# EAGLE board proiect (EAGLE 9.7.0)
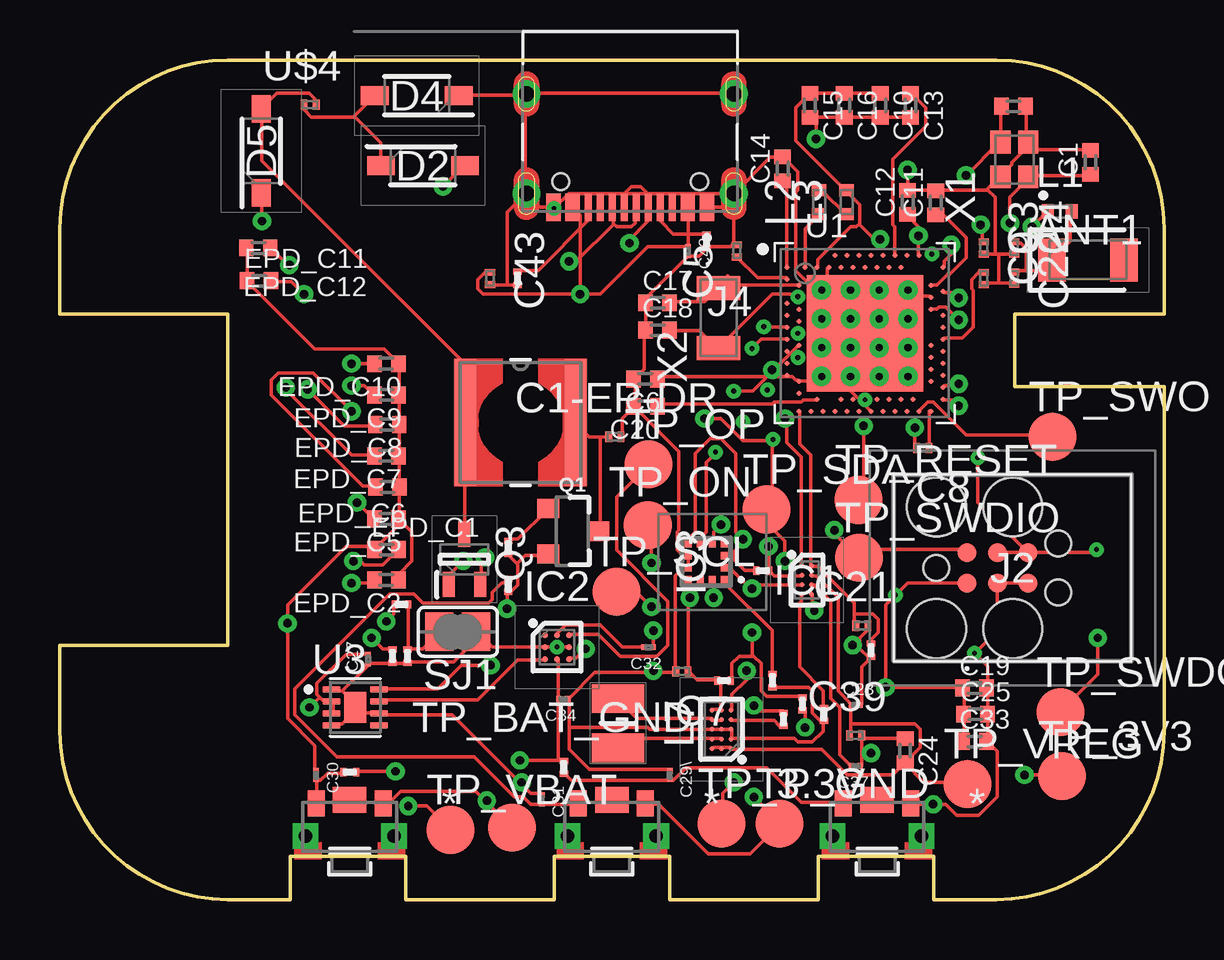
[diagram p2: board, top side]
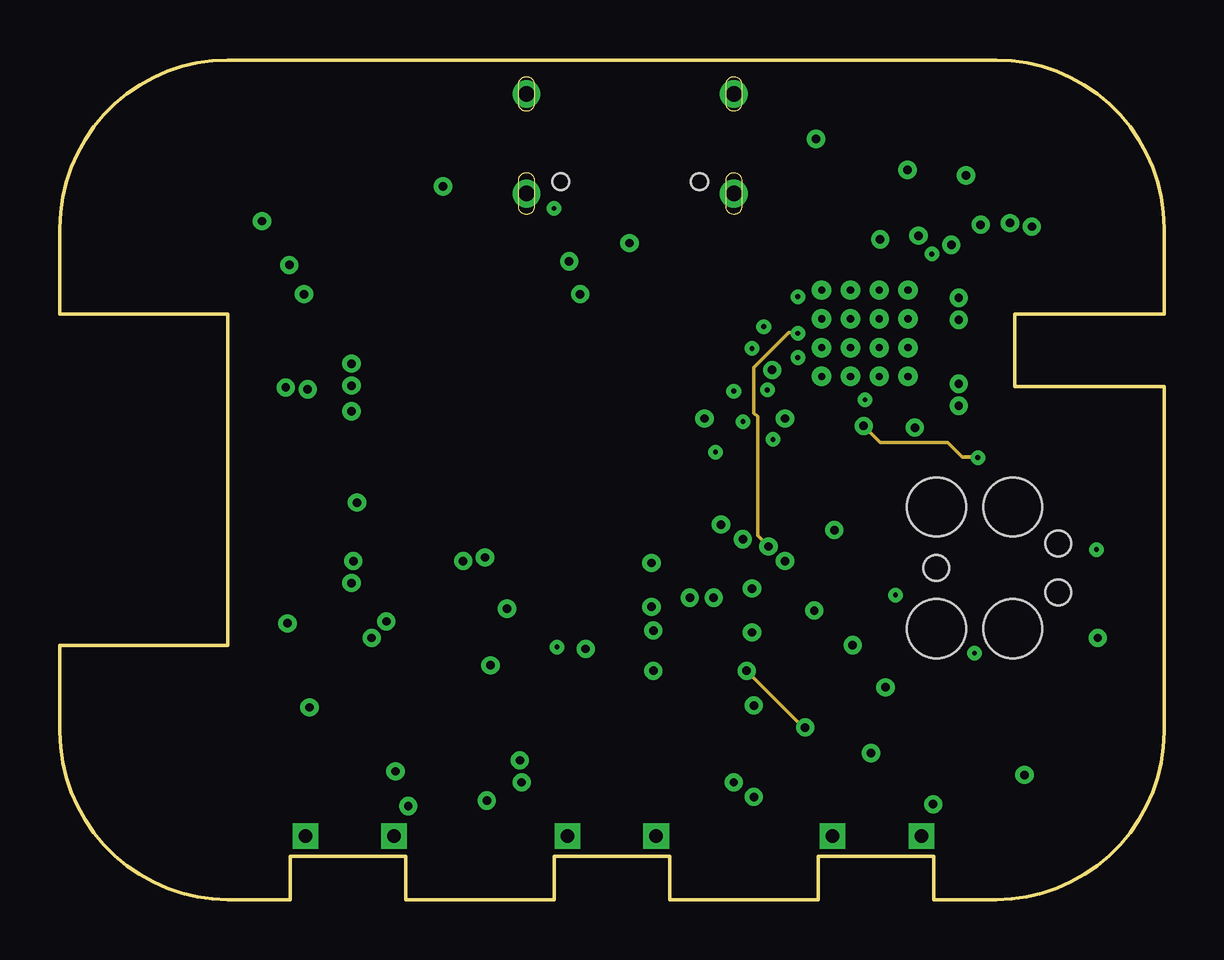
[diagram p3: board, inner layer Route2]
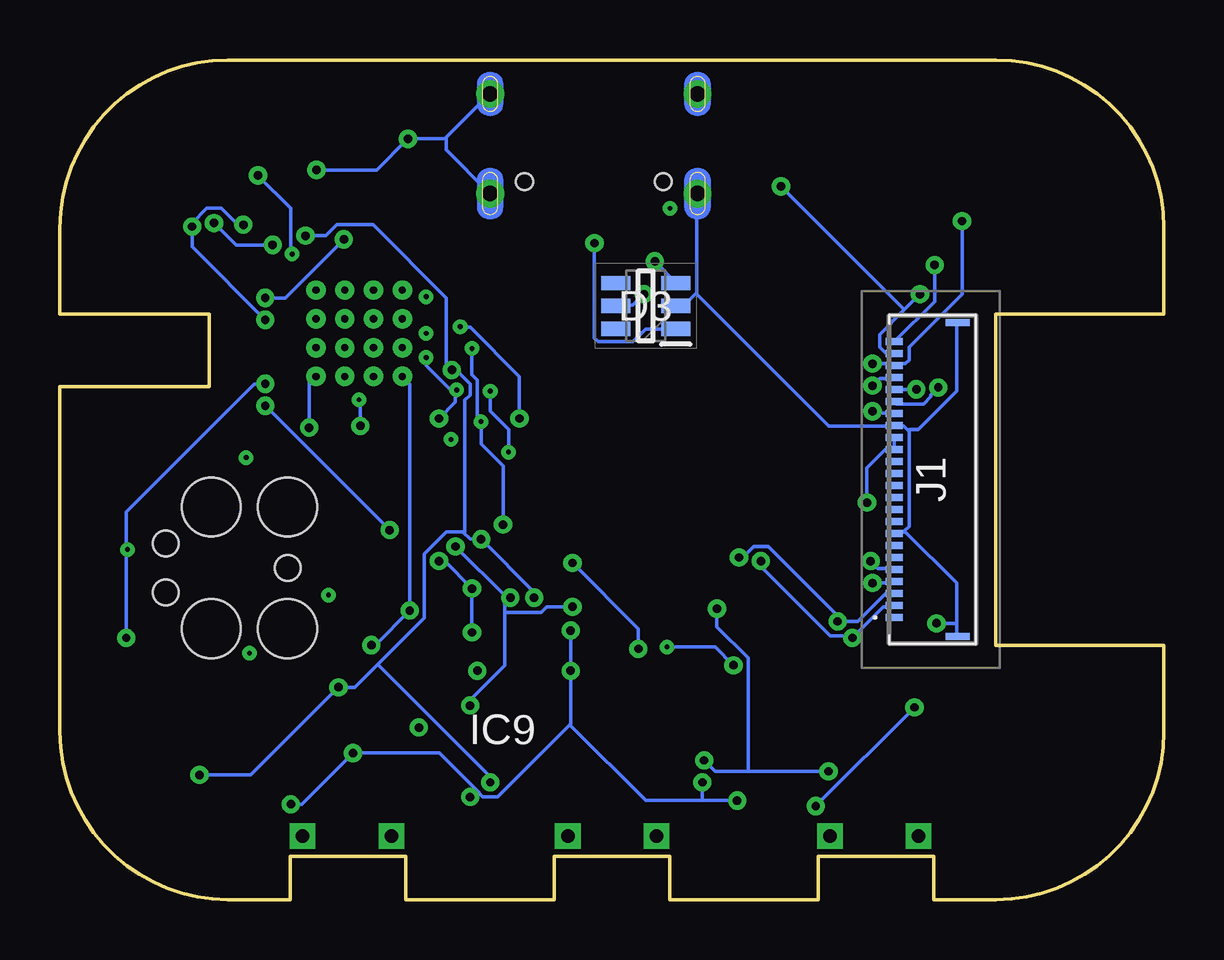
[diagram p4: board, bottom side, seen from below]

Size 46 x 35 mm. Coordinates in mm from the lower left corner, seen from the top.
Outline: 39,0 36.4,0 36.4,1.8 31.6,1.8 31.6,0 25.4,0 25.4,1.8 20.6,1.8 20.6,0 14.4,0 14.4,1.8 9.6,1.8 9.6,0 7,0 arc-90 0,7 0,10.6 7,10.6 7,24.4 0,24.4 0,28 arc-90 7,35 39,35 arc-90 46,28 46,24.66 46,24.41 45.75,24.41 39.78,24.41 39.78,23.02 39.78,21.38 40.52,21.38 46,21.38 46,7 arc-90 39,0
Copper layers (1+2*15+16): Top 0.035mm / dielectric 1.5mm / Route2 0.035mm / dielectric 0.15mm / Route15 0.035mm / dielectric 0.2mm / Bottom 0.035mm
Design rules "Fusion Electronics Design Rules *": minimum track width 6mil, minimum drill 0.35mm, track to track 6mil, track to pad 6mil, pad to pad 6mil, via to via 6mil, smd to smd 6mil, copper to edge 40mil, drill to drill 6mil, minimum pad ring 10mil, minimum via ring 8mil, stop-mask expansion 4mil, vias tented up to drill 9999mil, thermal gap 10mil
Net classes: 1 traseeDePutere: width 0.008 mm

## Footprints (pad centres in the part's own frame; a part is rotated, then mirrored left to right if it is on the bottom)
2450AT18B100E_ANTC3216X140N = smd 1.15 x 1.8: 1 -1.5,0; 2 1.5,0
PERFECT_0402_0402 = smd 0.6 x 0.7: 1 -0.5,0; 2 0.5,0
NORDIC_NRF_3_RESC0201_L = smd 0.28 x 0.43: 1 -0.255,0; 2 0.255,0
GRM011R60J152KE01L_2_CAPC0201X13N = smd 0.22 x 0.23: 1 -0.185,0; 2 0.185,0
GRM011R60J152KE01L_1_0201 = smd 0.35 x 0.25: 1 0,0.275; 2 0,-0.275
ESP32_C6_LIBRARY_5_SOD3716X135N = smd 1.15 x 0.8: 1 -1.75,0; 2 1.75,0
ESP32_C6_LIBRARY_3_SOT95P280X145-6N = smd 1.2 x 0.6: 1 -1.25,0.95; 2 -1.25,0; 3 -1.25,-0.95; 4 1.25,-0.95; 5 1.25,0; 6 1.25,0.95
BQ25180YBGR_BGA8C40P2X4_100X155X50 = smd 0.2 x 0.2: A1 -0.2,0.6; A2 0.2,0.6; B1 -0.2,0.2; B2 0.2,0.2; C1 -0.2,-0.2; C2 0.2,-0.2; D1 -0.2,-0.6; D2 0.2,-0.6
DRV2605YZFR_BGA9C50P3X3_144X144X62 = smd 0.25 x 0.25: A1 -0.5,0.5; A2 0,0.5; A3 0.5,0.5; B1 -0.5,0; B2 0,0; B3 0.5,0; C1 -0.5,-0.5; C2 0,-0.5; C3 0.5,-0.5
BMA423_BMA423 = smd 0.3 x 0.35: 1 -0.75,-0.775; 2 -0.25,-0.775; 3 0.25,-0.775; 4 0.75,-0.775; 7 0.75,0.775; 8 0.25,0.775; 9 -0.25,0.775; 10 -0.75,0.775 | smd 0.35 x 0.3: 5 0.775,-0.25; 6 0.775,0.25; 11 -0.775,0.25; 12 -0.775,-0.25
RT6160AWSC_BGA15C40P3X5_140X230X60 = smd 0.216 x 0.216: A1 -0.4,0.8; A2 0,0.8; A3 0.4,0.8; B1 -0.4,0.4; B2 0,0.4; B3 0.4,0.4; C1 -0.4,0; C2 0,0; C3 0.4,0; D1 -0.4,-0.4; D2 0,-0.4; D3 0.4,-0.4; E1 -0.4,-0.8; E2 0,-0.8; E3 0.4,-0.8
503480-2400_5034802400 = smd 0.3 x 0.7: 1 -5.75,1.525; 2 -5.25,1.525; 3 -4.75,1.525; 4 -4.25,1.525; 5 -3.75,1.525; 6 -3.25,1.525; 7 -2.75,1.525; 8 -2.25,1.525; 9 -1.75,1.525; 10 -1.25,1.525; 11 -0.75,1.525; 12 -0.25,1.525; 13 0.25,1.525; 14 0.75,1.525; 15 1.25,1.525; 16 1.75,1.525; 17 2.25,1.525; 18 2.75,1.525; 19 3.25,1.525; 20 3.75,1.525; 21 4.25,1.525; 22 4.75,1.525; 23 5.25,1.525; 24 5.75,1.525 | smd 0.3 x 1: MP1 -6.54,-1.125; MP2 6.54,-1.125
TC2030-IDC_TC2030IDC = smd 0.783 x 0.783: 1 -0.953,-0.635; 2 -0.953,0.635; 3 0.317,-0.635; 4 0.317,0.635; 5 1.588,-0.635; 6 1.588,0.635 | hole 2.451: -2.223,-2.54; -2.223,2.54; 0.952,-2.54; 0.952,2.54 | hole 1.067: -2.223,0; 2.857,-1.016; 2.857,1.016
KH-TYPE-C-16P_KINGHELM_KH-TYPE-C-16P = smd 0.6 x 1.15: A1_B12 -3.2,4.725; A4_B9 -2.4,4.725; A9_B4 2.4,4.725; A12_B1 3.2,4.725 | smd 0.3 x 1.15: A5 -1.25,4.725; A6 -0.25,4.725; A7 0.25,4.725; A8 1.25,4.725; B5 1.75,4.725; B6 0.75,4.725; B7 -0.75,4.725; B8 -1.75,4.725 | drill 0.65 pad 1.05: SH1 -4.32,0; SH2 4.32,0; SH3 -4.32,4.15; SH4 4.32,4.15 | hole 0.7: -2.89,3.65; 2.89,3.65
NORDIC_NRF_2_RESC0402_L = smd 0.5 x 0.6: 1 -0.5,0; 2 0.5,0
ESP32_C6_LIBRARY_2_IND_4828-WE-TPC_WRE = smd 0.9 x 5.3: 1 -2.286,0; 2 2.286,0
MLP2016SR47MT0S1_INDC2016X100N = smd 1.2 x 2.2: 1 -1.028,0; 2 1.028,0
ESP32_C6_LIBRARY_4_ESP32_C6_LIBRARY_4_ESP32_C6_LIBRARY_4_ESP32_C6_LIBRARY_4_ESP32_WROVER_SPARKFUN-DISCRETESEMI_SOT23-3 = smd 0.8 x 0.9: 1 -0.95,-1; 2 0.95,-1; 3 0,1.1
ESP32_C6_LIBRARY_6_SOT65P210X110-3N = smd 1.05 x 0.5: 1 -1.05,0.65; 2 -1.05,-0.65; 3 1.05,0
CPF0201D7K68C1_0201 = smd 0.35 x 0.25: 1 0,0.275; 2 0,-0.275
ESP32_C6_LIBRARY_7_JUMPER_SJ = smd 1.168 x 1.6: 1 -0.762,0; 2 0.762,0
2025-10-22_07-23-44_LIBRARY_SW_EVP-AKE31A_PAN = smd 0.711 x 1.092: 1 -1.4,-0.972; 2 1.4,-0.972 | drill 0.559 pad 0.914 square: 3 -1.848,0.381; 4 1.848,0.381 | smd 1.397 x 1.092: 5 0,-1.124
HECTOR_WATCH_1_TP20R = smd 2 x 2: TP 0,0
NORDIC_NRF_4_AQFN50P700X700X85_HS-74N = smd 4.85 x 4.85: P$74 0,0 | drill 0.3 pad 0.6: P$75 -1.8,1.8; P$76 -0.6,1.8; P$77 0.6,1.8; P$78 1.8,1.8; P$79 -1.8,0.6; P$80 -0.6,0.6; P$81 0.6,0.6; P$82 1.8,0.6; P$83 -1.8,-0.6; P$84 -0.6,-0.6; P$85 0.6,-0.6; P$86 1.8,-0.6; P$87 -1.8,-1.8; P$88 -0.6,-1.8; P$89 0.6,-1.8; P$90 1.8,-1.8 | smd 0.2 x 0.2: P$A8 -1.25,3.25; P$A10 -0.75,3.25; P$A12 -0.25,3.25; P$A14 0.25,3.25; P$A16 0.75,3.25; P$A18 1.25,3.25; P$A20 1.75,3.25; P$A22 2.25,3.25; P$A23 2.75,3.25; P$AA24 3.25,-2.25; P$AB2 -2.75,-2.5; P$AC5 -2,-2.75; P$AC9 -1,-2.75; P$AC11 -0.5,-2.75; P$AC13 0,-2.75; P$AC15 0.5,-2.75; P$AC17 1,-2.75; P$AC19 1.5,-2.75; P$AC21 2,-2.75; P$AC24 3.25,-2.75; P$AD2 -2.75,-3.25; P$AD4 -2.25,-3.25; P$AD6 -1.75,-3.25; P$AD8 -1.25,-3.25; P$AD10 -0.75,-3.25; P$AD12 -0.25,-3.25; P$AD14 0.25,-3.25; P$AD16 0.75,-3.25; P$AD18 1.25,-3.25; P$AD20 1.75,-3.25; P$AD22 2.25,-3.25; P$AD23 2.75,-3.25; P$B1 -3.25,2.75; P$B3 -2.5,2.75; P$B5 -2,2.75; P$B7 -1.5,2.75; P$B9 -1,2.75; P$B11 -0.5,2.75; P$B13 0,2.75; P$B15 0.5,2.75; P$B17 1,2.75; P$B19 1.5,2.75; P$B24 3.25,2.75; P$C1 -3.25,2.25; P$D2 -2.75,2; P$D23 2.75,2; P$E24 3.25,1.75; P$F2 -2.75,1.5; P$F23 2.75,1.5; P$G1 -3.25,1.25; P$H2 -2.75,1; P$H23 2.75,1; P$J1 -3.25,0.75; P$J24 3.25,0.75; P$K2 -2.75,0.5; P$L1 -3.25,0.25; P$L24 3.25,0.25; P$M2 -2.75,0; P$N1 -3.25,-0.25; P$N24 3.25,-0.25; P$P2 -2.75,-0.5; P$P23 2.75,-0.5; P$R1 -3.25,-0.75; P$R24 3.25,-0.75; P$T2 -2.75,-1; P$T23 2.75,-1; P$U1 -3.25,-1.25; P$U24 3.25,-1.25; P$V23 2.75,-1.5; P$W1 -3.25,-1.75; P$W24 3.25,-1.75; P$Y2 -2.75,-2; P$Y23 2.75,-2
ESP32_C6_LIBRARY_SON50P200X200X80-9N = smd 0.76 x 0.27: 1 -0.985,0.75; 2 -0.985,0.25; 3 -0.985,-0.25; 4 -0.985,-0.75; 5 0.985,-0.75; 6 0.985,-0.25; 7 0.985,0.25; 8 0.985,0.75 | smd 0.9 x 1.3: 9 0,0
NORDIC_NRF_BT-XTAL_2016_N = smd 0.95 x 0.85: 1 -0.725,-0.575; 2 0.725,-0.575; 3 0.725,0.575; 4 -0.725,0.575
NORDIC_NRF_1_XTAL_3215_N = smd 1 x 1.8: 1 -1.25,0; 2 1.25,0

## Placement (x,y rotation side)
ANT1  2450AT18B100E  [2450AT18B100E_ANTC3216X140N]  42.83,26.66 0 top
C1  12pF  [PERFECT_0402_0402]  42.94,30.73 90 top
C1-EP-DR  10uF  [NORDIC_NRF_3_RESC0201_L]  23.12,19.29 0 top
C2  12pF  [PERFECT_0402_0402]  39.72,33.07 0 top
C3  1pF  [NORDIC_NRF_3_RESC0201_L]  38.49,27.16 270 top
C4  1pF  [NORDIC_NRF_3_RESC0201_L]  39.76,27.16 270 top
C5  100nF  [NORDIC_NRF_3_RESC0201_L]  28.2,27.04 90 top
C6  4.7µF  [PERFECT_0402_0402]  24.39,21.7 180 top
C7  100nF  [NORDIC_NRF_3_RESC0201_L]  25.91,9.51 180 top
C8  100nF  [NORDIC_NRF_3_RESC0201_L]  35.95,18.82 180 top
C9  100nF  [NORDIC_NRF_3_RESC0201_L]  38.49,25.89 270 top
C10  N.C.  [PERFECT_0402_0402]  34.18,33.11 270 top
C11  100pF  [PERFECT_0402_0402]  36.49,29.04 90 top
C12  100nF  [PERFECT_0402_0402]  35.31,29.07 90 top
C13  N.C.  [PERFECT_0402_0402]  35.44,33.11 270 top
C14  4.7µF  [PERFECT_0402_0402]  30.11,30.47 90 top
C15  10µF  [PERFECT_0402_0402]  31.25,33.11 270 top
C16  47nF  [PERFECT_0402_0402]  32.68,33.11 270 top
C17  12pF  [PERFECT_0402_0402]  24.9,24.88 0 top
C18  12pF  [PERFECT_0402_0402]  24.9,23.73 0 top
C19  100nF  [PERFECT_0402_0402]  38.11,8.82 0 top
C20  4.7µF  [PERFECT_0402_0402]  24.39,20.56 180 top
C21  4.7µF  [NORDIC_NRF_3_RESC0201_L]  33.41,11.42 0 top
C22  N.C.  [NORDIC_NRF_3_RESC0201_L]  39.76,25.9 270 top
C23  0.1uF  [GRM011R60J152KE01L_2_CAPC0201X13N]  33.15,8.11 0 top
C24  10uF  [PERFECT_0402_0402]  35.22,6.21 270 top
C25  22uF  [PERFECT_0402_0402]  38.14,7.73 0 top
C27  0.1uF  [GRM011R60J152KE01L_2_CAPC0201X13N]  12.83,10.02 90 top
C29\  1uF  [GRM011R60J152KE01L_2_CAPC0201X13N]  25.41,5.19 270 top
C30  1uF  [GRM011R60J152KE01L_2_CAPC0201X13N]  10.67,5.19 270 top
C31  1uF  [GRM011R60J152KE01L_2_CAPC0201X13N]  20.07,4.18 270 top
C32  1uF  [GRM011R60J152KE01L_2_CAPC0201X13N]  24.52,10.53 180 top
C33  22uF  [PERFECT_0402_0402]  38.11,6.59 0 top
C34  0.1uF  [GRM011R60J152KE01L_2_CAPC0201X13N]  20.96,8.37 180 top
C37  1uF  [GRM011R60J152KE01L_2_CAPC0201X13N]  33.15,5.57 180 top
C38  1uF  [GRM011R60J152KE01L_1_0201]  33.79,10.39 180 top
C39  10uF  [NORDIC_NRF_3_RESC0201_L]  33.15,6.84 0 top
C42  0.1uF  [GRM011R60J152KE01L_2_CAPC0201X13N]  26.17,27.04 270 top
C43  4.3uF  [NORDIC_NRF_3_RESC0201_L]  17.91,25.89 270 top
D2  MBR0530  [ESP32_C6_LIBRARY_5_SOD3716X135N]  15.12,30.59 0 top
D3  USBLC6-2SC6Y  [ESP32_C6_LIBRARY_3_SOT95P280X145-6N]  21.6,24.75 180 bottom
D4  MBR0530  [ESP32_C6_LIBRARY_5_SOD3716X135N]  14.87,33.51 180 top
D5  MBR0530  [ESP32_C6_LIBRARY_5_SOD3716X135N]  8.39,31.2 90 top
EPD_C1  1uF/50V  [PERFECT_0402_0402]  13.6,14.59 0 top
EPD_C2  1uF/1.5V  [PERFECT_0402_0402]  13.6,13.32 180 top
EPD_C5  0.1uF/50V  [PERFECT_0402_0402]  13.6,15.86 180 top
EPD_C6  1uF/1.5V  [PERFECT_0402_0402]  13.65,17.19 180 top
EPD_C7  1uF/1.5V  [PERFECT_0402_0402]  13.6,18.49 180 top
EPD_C8  1uF/1.5V  [PERFECT_0402_0402]  13.64,19.8 180 top
EPD_C9  1uF/1.5V  [PERFECT_0402_0402]  13.61,21.03 180 top
EPD_C10  1uF/1.5V  [PERFECT_0402_0402]  13.6,22.34 180 top
EPD_C11  1uF/1.5V  [PERFECT_0402_0402]  8.3,25.8 0 top
EPD_C12  1uF/1.5V  [PERFECT_0402_0402]  8.26,27.16 0 top
IC1  BQ25180YBGR  [BQ25180YBGR_BGA8C40P2X4_100X155X50]  31.12,13.32 0 top
IC2  DRV2605YZFR  [DRV2605YZFR_BGA9C50P3X3_144X144X62]  20.71,10.53 0 top
IC3  BMA423  [BMA423_BMA423]  26.93,14.08 90 top
IC9  RT6160AWSC  [RT6160AWSC_BGA15C40P3X5_140X230X60]  27.57,7.1 180 top
J1  503480-2400  [503480-2400_5034802400]  9.72,17.51 90 bottom
J2  TC2030-IDC_TC2030-IDC  [TC2030-IDC_TC2030IDC]  38.74,13.83 0 top
J4  KH-TYPE-C-16P  [KH-TYPE-C-16P_KINGHELM_KH-TYPE-C-16P]  23.76,33.58 180 top
L1  3.9nH  [NORDIC_NRF_2_RESC0402_L]  41.66,28.69 0 top
L2  10uH  [NORDIC_NRF_2_RESC0402_L]  31.63,29.07 90 top
L3  15nH  [NORDIC_NRF_2_RESC0402_L]  32.77,29.07 90 top
L5  68uH  [ESP32_C6_LIBRARY_2_IND_4828-WE-TPC_WRE]  19.19,19.89 0 top
L7  FTC252012SR47MBCA  [MLP2016SR47MT0S1_INDC2016X100N]  23.25,7.35 90 top
Q1  20V/4.2A/52mΩ/1.4W  [ESP32_C6_LIBRARY_4_ESP32_C6_LIBRARY_4_ESP32_C6_LIBRARY_4_ESP32_C6_LIBRARY_4_ESP32_WROVER_SPARKFUN-DISCRETESEMI_SOT23-3]  21.34,15.35 270 top
Q3  \SI1308EDL-T1-GE3  [ESP32_C6_LIBRARY_6_SOT65P210X110-3N]  16.85,14.18 90 top
R1  10K  [CPF0201D7K68C1_0201]  31.83,7.72 180 top
R1_EP_DR  0.47  [CPF0201D7K68C1_0201]  14.23,12.3 270 top
R1_USB  5K1  [CPF0201D7K68C1_0201]  26.93,27.44 180 top
R2  0  [CPF0201D7K68C1_0201]  30.93,8.15 0 top
R2_EP_DR  10K  [CPF0201D7K68C1_0201]  13.85,10.15 180 top
R2_USB  5K1  [CPF0201D7K68C1_0201]  19.06,25.89 0 top
R3  0  [CPF0201D7K68C1_0201]  29.69,9.13 180 top
R4  0  [CPF0201D7K68C1_0201]  30.14,7.51 0 top
R5  10K  [CPF0201D7K68C1_0201]  12.07,5.32 90 top
R7  10K  [CPF0201D7K68C1_0201]  20.99,5.51 180 top
R8  10K  [CPF0201D7K68C1_0201]  18.68,13.09 0 top
R17  3K3  [CPF0201D7K68C1_0201]  29.28,13.71 90 top
R18  3K3  [CPF0201D7K68C1_0201]  27.66,9.13 90 top
R_PWR_EPD  10K  [CPF0201D7K68C1_0201]  18.68,14.68 0 top
R_TYPE_SEL  2.2  [CPF0201D7K68C1_0201]  14.48,10.15 180 top
SJ1  [ESP32_C6_LIBRARY_7_JUMPER_SJ]  16.57,11.16 180 top
SW_DN  2025-10-22_07-23-44_LIBRARY_EVP-AKE31ASW_EVP-AKE31A_PAN  [2025-10-22_07-23-44_LIBRARY_SW_EVP-AKE31A_PAN]  34.04,3.03 180 top
SW_ENT  2025-10-22_07-23-44_LIBRARY_EVP-AKE31ASW_EVP-AKE31A_PAN  [2025-10-22_07-23-44_LIBRARY_SW_EVP-AKE31A_PAN]  22.99,3.03 180 top
SW_UP  2025-10-22_07-23-44_LIBRARY_EVP-AKE31ASW_EVP-AKE31A_PAN  [2025-10-22_07-23-44_LIBRARY_SW_EVP-AKE31A_PAN]  12.07,3.03 180 top
TP_3.3V  HECTOR_WATCH_1_TPTP20R  [HECTOR_WATCH_1_TP20R]  27.57,3.16 0 top
TP_3V3  HECTOR_WATCH_1_TPTP20R  [HECTOR_WATCH_1_TP20R]  41.75,5.14 0 top
TP_BAT_GND  HECTOR_WATCH_1_TPTP20R  [HECTOR_WATCH_1_TP20R]  18.84,3 0 top
TP_GND  HECTOR_WATCH_1_TPTP20R  [HECTOR_WATCH_1_TP20R]  29.98,3.16 0 top
TP_ON  HECTOR_WATCH_1_TPTP20R  [HECTOR_WATCH_1_TP20R]  24.49,15.61 0 top
TP_OP  HECTOR_WATCH_1_TPTP20R  [HECTOR_WATCH_1_TP20R]  24.52,18.14 0 top
TP_RESET  HECTOR_WATCH_1_TPTP20R  [HECTOR_WATCH_1_TP20R]  33.28,16.66 0 top
TP_SCL  HECTOR_WATCH_1_TPTP20R  [HECTOR_WATCH_1_TP20R]  23.19,12.83 0 top
TP_SDA  HECTOR_WATCH_1_TPTP20R  [HECTOR_WATCH_1_TP20R]  29.44,16.26 0 top
TP_SWDCLK  HECTOR_WATCH_1_TPTP20R  [HECTOR_WATCH_1_TP20R]  41.68,7.8 0 top
TP_SWDIO  HECTOR_WATCH_1_TPTP20R  [HECTOR_WATCH_1_TP20R]  33.3,14.25 0 top
TP_SWO  HECTOR_WATCH_1_TPTP20R  [HECTOR_WATCH_1_TP20R]  41.35,19.29 0 top
TP_VBAT  HECTOR_WATCH_1_TPTP20R  [HECTOR_WATCH_1_TP20R]  16.26,2.91 0 top
TP_VREG  HECTOR_WATCH_1_TPTP20R  [HECTOR_WATCH_1_TP20R]  37.81,4.82 0 top
U1  NRF52840_QF  [NORDIC_NRF_4_AQFN50P700X700X85_HS-74N]  33.53,23.61 0 top
U3  MAX17048G+T10  [ESP32_C6_LIBRARY_SON50P200X200X80-9N]  12.3,8.01 0 top
U$4  4.7uF/25V  [NORDIC_NRF_3_RESC0201_L]  10.42,33.13 0 top
X1  32MHz  [NORDIC_NRF_BT-XTAL_2016_N]  39.77,30.85 90 top
X2  32.768kHz  [NORDIC_NRF_1_XTAL_3215_N]  27.44,24.25 90 top

## Tracks (layer width: path | path; a pad name or v marks a point on that pad's centre or on a via)
3V3/1.7D  (via drill 0.35)
  Top 0.152: 19.04,13.99 18.7,14.34 R_PWR_EPD.2 | 19.04,13.99 19.08,13.95 19.08,13.12 18.85,12.89 18.7,12.89 R8.2 18.62,12.81 v18.62,12.13 | Q1.2 20.3,14.34 19.39,14.34 19.08,14.03 19.04,13.99 | IC2.C2 20.76,9.99 20.76,8.39 C34.2 20.76,8.32 20.76,5.8 | v13.98,5.34 12.38,5.34 R5.2 | 20.76,5.8 20.99,5.8 R7.2 | 20.76,5.8 v19.16,5.8
  Bottom 0.152: 17.33,5.34 18.7,5.34 v19.16,5.8 | 17.33,5.34 v13.98,5.34 | v18.62,12.13 18.62,11.36 17.33,10.07 17.33,5.34
3V3/2.4A  (via drill 0.2, 0.35)
  Top 0.152: 27.54,7.94 27.24,7.94 IC9.E3 | 27.54,7.94 IC9.E2 | 27.54,7.94 27.54,8.01 27.54,9 27.46,9.08 R18.1 27.39,9.15 26.55,9.15 26.24,9.46 C7.1 26.17,9.54 26.17,12.58 | 26.17,12.58 26.17,13.27 IC3.10 | 28.04,14.22 28,14.26 27.77,14.26 IC3.3 | 28.04,14.22 28.11,14.15 | 28.11,14.15 28.53,13.73 28.99,13.73 R17.1 | IC3.7 26.17,14.87 26.17,15.02 26.47,15.33 26.47,18.6 27.08,19.21 27.54,19.21 28.15,18.6 28.15,15.33 v28.45,15.02 28.38,15.02 28.38,14.79 28.07,14.49 28.07,14.26 28.04,14.22 | 28.15,14.18 28.11,14.15 | C33.1 37.67,6.64 37.67,7.71 C25.1 37.67,7.78 37.67,8.77 C19.1 37.6,8.85 v34.4,8.85 34.4,12.28 v34.81,12.7 35.31,13.19 J2.1 | U1.P$A22 35.77,26.91 v35.77,27.67 35.77,28.05 35.31,28.51 C12.1 | U1.P$W1 30.36,21.8 30.44,21.8 30.51,21.8 30.66,21.65 30.74,21.65 U1.P$Y2 32.53,21.61 U1.P$AD14 | 25.03,21.8 24.95,21.73 C6.1 25.03,21.8 | 30.28,21.8 U1.P$W1 | v28.07,4.89 27.62,4.43 27.62,3.21 TP_3.3V.TP | v40.19,5.19 41.71,5.19 TP_3V3.TP | v26.24,12.58 26.17,12.58 | 29.67,21.8 v29.67,22.08 | 29.67,21.8 30.21,21.8 U1.P$W1 | 29.67,21.8 v29.67,22.08 | 25.03,21.8 29.6,21.8 v29.67,22.08
  Bottom 0.152: v35.77,27.67 34.93,27.67 34.48,28.13 32.95,28.13 29.9,25.08 29.9,22.34 29.67,22.11 v29.67,22.08 | 32.76,9.8 30.82,11.75 30.82,14.41 29.9,15.33 29.22,15.33 29.18,15.29 | 32.76,9.8 33.71,8.85 v34.4,8.85 38.06,5.19 v40.19,5.19 | 29.18,15.29 28.91,15.02 v28.45,15.02 26.24,12.81 v26.24,12.58 | v28.07,4.89 28.07,5.12 32.72,9.76 32.76,9.8 | v29.67,22.08 | 29.18,15.29 29.14,15.33 29.14,20.81 28.91,21.04 28.91,21.5 29.45,22.03 29.6,22.03 v29.67,22.08
DN  (via drill 0.35)
  Top 0.152: J4.A7 23.58,28.89 23.58,29.5 23.81,29.73 24.19,29.73 24.49,29.42 24.49,28.89 J4.B7 24.49,28.81 24.49,28.28 23.73,27.52 v23.73,27.37
  Bottom 0.152: v23.73,27.37 23.73,23.4 23.58,23.25 22.13,23.25 21.6,23.79 20.38,23.79 D3.1
DP  (via drill 0.35)
  Top 0.152: 23.08,28.17 23.2,28.05 23.81,28.05 23.96,28.2 23.96,28.81 J4.A6 | 23.08,28.17 23.04,28.2 23.04,28.81 J4.B6 | v21.22,26.6 21.52,26.6 23.04,28.13 23.08,28.17
  Bottom 0.152: v21.22,26.6 20.38,25.77 D3.3
EPD_3V3
  Top 0.152: 22.51,19.29 22.05,19.29 21.52,19.82 L5.2 | 22.51,19.29 22.82,19.29 C1-EP-DR.1 | 22.51,19.29 22.51,15.4 Q1.3
GDR  (via drill 0.35)
  Top 0.152: v12.99,10.91 13.44,10.45 13.82,10.45 R2_EP_DR.2 | v16.8,14.11 16.26,13.57 16.26,13.19 Q3.1
  Bottom 0.152: J1.2 11.31,12.2 11.69,12.2 v12.99,10.91 12.99,10.98 13.9,10.98 16.8,13.88 v16.8,14.11
GND  (via drill 0.2, 0.35)
  Top 0.152: 19.2,4.85 16.34,7.71 13.29,7.71 U3.6 13.21,7.78 12.3,7.78 U3.9 | 19.2,4.85 19.62,4.43 20.07,4.43 C31.1 | U3.4 11.39,7.33 11.77,7.33 12.38,7.94 U3.9 | 11.77,8.7 11.39,8.7 U3.1 | 11.77,8.7 12.3,8.16 U3.9 | U3.9 | 11.77,8.7 12.83,9.76 C27.1 13.82,9.84 R2_EP_DR.1 13.9,9.84 14.43,9.84 R_TYPE_SEL.1 14.51,9.92 16.41,9.92 17.48,10.98 SJ1.1 17.41,11.14 18.02,10.53 20.15,10.53 IC2.B1 IC2.B3 | SW_ENT.1 24.42,3.97 24.95,3.97 27.01,1.92 28.76,1.92 29.98,3.14 TP_GND.TP 29.98,3.21 v28.91,4.28 | 17.75,4.09 18.78,3.06 TP_BAT_GND.TP | 17.75,4.09 17.33,4.51 14.21,4.51 13.75,4.05 13.52,4.05 SW_UP.1 | 38.67,8.24 38.67,7.78 C25.2 38.67,7.71 38.67,6.64 C33.2 38.67,6.56 39.05,6.18 39.05,4.28 38.28,3.52 37.37,3.52 36.91,3.97 v36.38,3.97 35.46,3.97 SW_DN.1 | 38.67,8.24 38.67,8.77 C19.2 | 28,6.72 28,7.1 IC9.C1 27.92,7.1 27.62,7.1 IC9.C2 27.54,7.1 27.24,7.1 IC9.C3 24.57,7.1 24.49,7.17 21.22,7.17 | 28,6.72 IC9.B1 | R3.1 29.75,8.85 31.2,8.85 31.35,8.7 31.35,7.78 31.66,7.48 31.81,7.48 R1.1 31.81,7.4 31.81,7.02 31.35,6.56 30.74,6.56 30.59,6.72 28.07,6.72 28,6.72 | 33.41,6.72 33.41,6.79 C39.2 33.41,6.72 | 33.41,6.72 33.41,6.11 | 33.41,6.11 33.41,5.57 C37.1 | 33.41,6.72 35.16,6.72 C24.1 | 24.72,9.46 25.64,9.46 C7.2 | 24.72,9.46 22.28,9.46 21.22,8.39 C34.1 21.22,8.32 21.22,7.17 | v24.72,11.21 24.72,10.53 C32.1 | 24.72,9.46 v24.72,9.54 | 21.22,7.17 21.22,6.26 22.05,5.42 25.41,5.42 C29\.1 | 25.64,9.54 C7.2 | v33.79,6.11 33.41,6.11 | v17.79,4.12 17.75,4.09 | v19.23,4.89 19.2,4.85 | C30.1 10.62,5.42 10.62,6.41 9.48,7.55 v9.48,11.52 9.48,12.28 11.92,14.72 12.99,14.72 13.06,14.64 EPD_C1.1 13.14,14.64 14.21,15.71 EPD_C5.1
  Top 0.152: 14.13,15.86 14.66,15.33 14.66,14.11 14.13,13.57 14.13,13.34 EPD_C2.1 | 14.13,15.86 EPD_C5.1 | EPD_C12.1 7.8,27.14 7.8,25.84 EPD_C11.1 7.8,25.77 10.62,22.95 13.52,22.95 14.13,22.34 | 14.13,22.34 14.13,21.04 EPD_C9.1 14.13,20.97 14.13,19.82 EPD_C8.1 14.13,19.75 14.13,18.53 EPD_C7.1 14.13,18.45 14.13,17.23 EPD_C6.1 14.13,17.16 14.13,15.86 | 14.13,22.34 EPD_C10.1 14.13,22.34 | 14.13,15.86 EPD_C5.1 | v35.62,19.67 35.62,18.83 C8.2 | U1.P$B7 31.96,26.3 31.96,25.61 31.81,25.46 U1.P$74 | U1.P$F23 36.23,25.16 35.62,25.16 35.39,25.39 U1.P$74 | U1.P$83 31.81,23.02 32.88,23.02 U1.P$74 | U1.P$79 31.81,24.24 31.96,24.24 32.42,24.7 U1.P$74 | U1.P$74 31.73,25.46 U1.P$75 31.66,25.46 31.43,25.46 30.66,26.22 30.66,29.5 30.74,29.58 30.74,30.34 30.13,30.95 C14.2 30.05,30.95 29.6,30.95 28.15,29.5 J4.SH3 | U1.P$74 32.95,23.02 U1.P$84 32.95,22.95 32.95,21.88 U1.P$88 32.88,21.8 31.81,21.8 U1.P$87 | U1.P$80 32.95,24.24 U1.P$74 | U1.P$76 32.88,25.39 32.34,24.85 U1.P$74 | U1.P$74 34.17,22.95 34.17,21.88 U1.P$89 34.25,21.88 35.31,21.88 U1.P$90 | U1.P$74 34.17,23.02 U1.P$85 34.25,23.02 35.31,23.02 U1.P$86 | U1.P$81 34.17,24.24 U1.P$74 | 34.78,24.78 35.31,24.24 U1.P$82 | 34.78,24.78 U1.P$74 | 34.78,24.78 34.17,25.39 U1.P$77 | 34.78,24.78 U1.P$74 | U1.P$78 35.39,25.46 U1.P$74 | C23.2 33.41,8.16 33.41,9.69 33.79,10.07 C38.1 33.71,10.07 33.33,10.45 33.33,10.6 | 33.33,10.6 33.33,10.91 33.64,11.21 33.64,11.36 C21.2 | v31.43,12.05 31.35,12.13 31.35,12.66 IC1.D2 | 33.33,10.6 v33.03,10.6 | 39.12,26.91 39.73,26.91 C4.2 | 39.12,26.91 38.97,26.91 | 38.97,26.91 38.51,26.91 C3.2 | 39.12,25.69 39.73,25.69 C22.2
  Top 0.152: 39.12,25.69 38.51,25.69 C9.2 | 39.12,25.69 39.12,26.91 | C12.2 36.46,29.58 C11.2 36.53,29.58 38.59,29.58 38.63,29.61 | C12.2 | C2.2 40.27,33.01 40.27,31.71 40.34,31.63 X1.2 | C1.2 42.93,31.25 40.72,31.25 40.42,31.56 X1.2 | X1.2 40.42,31.48 39.66,30.72 39.66,30.64 39.2,30.19 X1.4 39.12,30.11 38.63,29.61 | 38.97,26.91 38.97,29.27 38.67,29.58 38.63,29.61 | 18.62,25.61 17.94,25.61 C43.2 | 18.62,25.61 19.01,25.61 R2_USB.2 | 19.44,29.45 19.46,29.5 J4.SH4 | J4.SH4 19.39,29.5 19.39,33.54 J4.SH2 | 18.62,25.61 18.62,28.66 19.39,29.42 J4.SH4 | D4.1 16.64,33.54 19.31,33.54 J4.SH2 | C13.2 35.39,32.62 34.25,32.62 C10.2 34.17,32.62 32.72,32.62 C16.2 32.65,32.62 31.5,32.62 | 31.5,32.62 31.27,32.62 C15.2 31.5,32.62 | v31.5,31.71 31.5,32.62 | C1-EP-DR.2 23.43,19.29 23.43,20.05 23.88,20.51 C20.2 | C20.2 23.96,20.58 23.96,21.65 C6.2 23.96,21.73 24.34,22.11 24.34,23.71 C18.1 24.42,23.79 24.42,24.85 C17.1 24.42,24.93 24.42,25.08 26.17,26.83 | 26.17,26.83 26.63,26.83 26.93,27.14 R1_USB.1 26.93,27.21 27.92,27.21 28.07,27.37 C5.2 28.15,27.37 28.07,27.44 28.07,29.27 | 26.17,26.83 C42.2 26.17,26.83 | v28.07,29.32 28.07,29.35 J4.SH3 | 28.07,29.27 J4.SH3 | J4.SH2 19.46,33.62 28.07,33.62 J4.SH1 | v35.31,30.41 C12.2 | 23.96,20.51 C20.2 | C7.2 25.64,9.61 25.64,13.5 25.94,13.8 26.09,13.8 IC3.9 26.17,13.88 26.17,14.26 IC3.8 26.09,14.34 25.94,14.34 25.71,14.56 25.71,15.33 25.79,15.4 25.79,18.68 23.96,20.51 | 23.96,20.51 C20.2 | 38.67,8.24 38.67,9.71 v38.11,10.27 39.06,11.22 J2.3 J2.5 | J4.A1_B12 27.66,28.86 28.07,29.27 | J4.SH4 20.01,28.86 J4.A12_B1 | J4.SH3 21.2,29.43 v20.58,28.81
  Bottom 0.152: v24.72,11.21 v24.72,9.54 24.72,7.33 24.76,7.29 | 28.64,4.54 28.38,4.28 27.77,4.28 24.76,7.29 | 28.64,4.54 30.21,6.11 v33.79,6.11 35.92,3.97 v36.38,3.97 | 19.23,4.12 21.6,4.12 24.72,7.25 24.76,7.29 | 19.23,4.12 v17.79,4.12 | v28.91,4.28 28.68,4.51 28.64,4.54 | 19.23,4.12 v19.23,4.89 | v35.62,19.67 35.62,21.58 35.39,21.8 U1.P$90 | U1.P$87 31.43,21.5 v31.43,12.05 32.88,10.6 v33.03,10.6 | 10.81,15.37 10.62,15.56 10.62,19.52 10.66,19.56 | 10.81,15.37 10.85,15.33 11.23,15.33 J1.8 | 10.66,19.56 10.85,19.75 11.23,19.75 J1.17 11.31,19.75 13.98,19.75 19.46,25.23 19.5,25.27 | 8.64,11.52 8.64,13.19 10.78,15.33 10.81,15.37 | 8.64,11.52 8.64,10.98 J1.MP1 | J1.MP2 8.64,24.01 8.64,21.19 10.24,19.59 10.62,19.59 10.66,19.56 | 19.5,25.27 19.46,25.31 19.46,29.42 J4.SH4 | 19.5,25.27 20,24.78 20.3,24.78 D3.2 | 29.94,31.75 28.15,33.54 J4.SH1 | 29.94,31.75 29.98,31.71 v31.5,31.71 32.8,30.41 v35.31,30.41 | 29.94,31.75 29.9,31.71 29.9,31.25 28.15,29.5 J4.SH3 | 8.64,11.52 v9.48,11.52
IMU_INT1  (via drill 0.2, 0.35)
  Top 0.152: v27.54,15.63 27.24,15.33 27.24,14.87 IC3.5 | U1.P$N1 29.22,23.36 v28.84,22.97
  Bottom 0.152: v27.54,15.63 27.54,18.07 28.45,18.98 28.45,19.9 v28.45,19.92 28.45,19.98 28.61,20.13 28.61,21.65 28.84,21.88 28.84,22.95 v28.84,22.97
IMU_INT2  (via drill 0.2)
  Top 0.152: IC3.6 26.7,14.87 26.7,15.1 26.93,15.33 26.93,18.22 27.31,18.6 v27.31,18.65 | U1.P$P2 28.87,21.19 v28.07,21.19
  Bottom 0.152: v28.07,21.19 28.07,20.36 27.31,19.59 27.31,18.68 v27.31,18.65
LX1
  Top 0.152: IC9.B2 27.54,6.72 27.24,6.72 IC9.B3 27.16,6.72 23.65,6.72 23.27,6.34 L7.1
LX2
  Top 0.152: IC9.D2 27.54,7.48 27.24,7.48 IC9.D3 27.16,7.55 24.03,7.55 23.27,8.32 L7.2
N$1
  Top 0.152: U1.P$AD23 36.23,20.36 36.23,18.83 C8.1
N$2
  Top 0.152: IC1.D1 30.89,12.66 30.89,12.43 30.82,12.36 30.82,9.69 31.81,8.7 31.81,8.01 R1.2
N$3
  Top 0.152: IC9.D1 28,7.48 29.75,7.48 29.98,7.25 R4.2
N$5  (via drill 0.35)
  Top 0.152: v28.61,9.54 28.61,9.15 28,8.55 28,7.94 IC9.E1 | v31.05,7.17 31.05,7.78 30.97,7.86 R2.2
  Route2 0.152: v28.61,9.54 30.97,7.17 v31.05,7.17
N$9
  Top 0.152: IC3.1 27.77,13.27 27.77,13.12 29.67,11.21 29.67,9.46 R3.2
N$15
  Top 0.152: U1.P$N24 36.84,23.4 37.6,23.4 38.06,23.86 38.06,25.39 37.98,25.46 37.98,25.84 38.28,26.15 38.44,26.15 C9.1
N$18  (via drill 0.35)
  Top 0.152: v37.45,24.17 36.91,24.7 36.61,24.7 36.53,24.62 36.3,24.62 U1.P$H23 | v40.49,28.05 41.1,28.66 L1.1 | v38.36,28.13 38.44,28.05 38.44,27.44 C3.1
  Bottom 0.152: v37.45,24.17 40.49,27.21 v40.49,28.05 40.49,28.2 39.88,28.81 39.27,28.81 38.59,28.13 v38.36,28.13
N$19
  Top 0.152: L2.2 31.66,29.5 31.81,29.5 32.72,28.59 L3.1
N$20  (via drill 0.35)
  Top 0.152: C10.1 32.72,33.62 C16.1 32.65,33.62 31.27,33.62 C15.1 31.2,33.54 30.66,33.01 30.66,31.63 32.72,29.58 L3.2 32.8,29.5 33.33,28.97 33.33,28.2 33.29,28.17 | 33.29,28.17 33.18,28.05 32.95,28.05 31.58,26.68 31.58,26.38 U1.P$B5 | v37.45,25.08 37.22,25.31 36.84,25.31 U1.P$E24 | v34.17,27.52 33.94,27.52 33.33,28.13 33.29,28.17
  Bottom 0.152: v37.45,25.08 36.61,25.08 v34.17,27.52
N$21
  Top 0.152: U1.P$D23 36.3,25.61 36.53,25.61 36.99,26.07 37.07,26.07 37.75,26.76 37.75,27.59 36.84,28.51 36.53,28.51 C11.1
N$22  (via drill 0.35)
  Top 0.152: v37.14,27.29 37.14,26.91 36.84,26.6 36.84,26.38 U1.P$B24 | v39.58,28.2 39.58,29.27 40.42,30.11 X1.1 40.42,30.19 42.93,30.19 C1.1
  Bottom 0.152: v37.14,27.29 38.67,27.29 v39.58,28.2
N$23  (via drill 0.2, 0.35)
  Top 0.152: U1.P$A23 36.3,26.91 v36.33,26.91 | v37.75,30.19 39.12,31.56 X1.3 39.2,31.63 39.2,33.01 C2.1
  Bottom 0.152: v37.75,30.19 36.38,28.81 36.38,26.91 v36.33,26.91
N$25
  Top 0.152: 40.27,26.22 40.95,26.22 41.33,26.6 ANT1.1 41.33,26.68 42.09,27.44 42.09,28.66 L1.2 | 40.27,26.22 39.81,26.22 C22.1 | 40.27,26.22 40.27,27.14 40.04,27.37 39.81,27.37 C4.1
N$26
  Top 0.152: U1.P$C1 30.28,25.92 29.06,25.92 28.23,26.76 C5.1
N$27
  Top 0.152: U1.P$A18 34.78,26.91 34.78,28.05 34.7,28.13 34.7,30.87 36.07,32.24 36.07,33.01 35.46,33.62 C13.1
N$28
  Top 0.152: 27.39,25.46 26.85,24.93 25.41,24.93 C17.2 | 27.39,25.46 X2.2 | U1.P$D2 28.23,25.61 27.82,26.02 27.39,25.59 27.39,25.46
N$40
  Top 0.152: U1.P$B3 31.05,26.38 31.05,27.98 31.58,28.51 L2.1
N$41
  Top 0.152: U1.P$B1 30.28,26.38 30.28,29.81 30.13,29.96 C14.1
N$43  (via drill 0.2)
  Top 0.152: U1.P$F2 30.74,25.16 v30.74,25.13 30.66,25.16 30.51,25.16 30.44,25.23 29.67,25.23 27.46,23.02 | X2.1 27.46,23.02 | 25.41,23.71 C18.2 25.48,23.71 26.63,23.71 27.31,23.02 X2.1 | 27.39,23.02 X2.1 | 27.46,23.02 X2.1
N$46
  Top 0.152: U1.P$AC5 31.5,20.81 31.43,20.81 30.97,20.81 30.89,20.74 29.75,20.74 29.67,20.66 25.1,20.66 C20.1 24.95,20.58 25.08,20.71
N$47
  Top 0.152: U$4.2 10.62,33.16 10.62,33.39 10.4,33.62 9.02,33.62 8.41,33.01 D5.2 8.41,32.93 8.41,30.8 16.87,22.34 16.87,19.9 L5.1 16.87,19.82 16.87,15.25 Q3.3
N$48
  Top 0.152: 12.26,32.66 13.06,33.46 D4.2 | 12.26,32.66 12.22,32.62 10.47,32.62 10.17,32.93 10.17,33.08 U$4.1 | D2.1 13.37,30.64 13.37,31.56 12.3,32.62 12.26,32.66
N$49  (via drill 0.35)
  Top 0.152: v12.15,13.19 12.99,13.19 13.06,13.27 EPD_C2.2
  Bottom 0.152: v12.15,13.19 11.31,13.19 J1.4
N$50  (via drill 0.35)
  Top 0.152: v12.22,14.11 12.53,14.11 12.68,13.95 13.44,13.95 14.05,14.56 EPD_C1.2
  Bottom 0.152: v12.22,14.11 11.92,13.8 11.31,13.8 J1.5
N$54
  Top 0.152: R2_USB.1 19.08,26.22 19.92,26.22 22.05,28.36 22.05,28.81 J4.B5
N$57
  Top 0.152: C32.2 24.26,10.53 23.43,10.53 22.51,11.44 21.06,11.44 20.68,11.06 IC2.A2
N$60  (via drill 0.35)
  Top 0.152: v12.38,16.55 13.06,15.86 EPD_C5.2
  Bottom 0.152: v12.38,16.55 12.38,17.99 11.61,18.76 11.31,18.76 J1.15 11.23,18.83 11.23,19.21 J1.16
N$61
  Top 0.152: R1_USB.2 26.93,27.75 25.56,27.75 25.03,28.28 25.03,28.81 J4.A5
N$63  (via drill 0.35)
  Top 0.152: v12.15,20.36 10.55,21.96 9.1,21.96 8.79,21.65 8.79,21.04 12.6,17.23 13.14,17.23 EPD_C6.2
  Bottom 0.152: v12.15,20.36 12.07,20.28 11.31,20.28 J1.18
N$64  (via drill 0.35)
  Top 0.152: v9.4,21.35 9.4,21.27 12.15,18.53 13.06,18.53 EPD_C7.2
  Bottom 0.152: v9.4,21.35 9.71,21.04 9.71,20.97 10.01,20.66 11.16,20.66 11.23,20.74 J1.19
N$65  (via drill 0.35)
  Top 0.152: v10.32,21.27 11.84,19.75 13.06,19.75 EPD_C8.2
  Bottom 0.152: v10.32,21.27 J1.20
N$66  (via drill 0.35)
  Top 0.152: v12.15,21.42 12.68,21.42 13.06,21.04 EPD_C9.2
  Bottom 0.152: v12.15,21.42 11.84,21.73 11.31,21.73 J1.21
N$68
  Top 0.152: SJ1.2 15.81,11.14 15.12,10.45 14.51,10.45 R_TYPE_SEL.2 14.51,10.53 14.51,12.28 R1_EP_DR.1
N$69  (via drill 0.35)
  Top 0.152: v9.56,26.45 9.48,26.45 8.79,27.14 EPD_C12.2
  Bottom 0.152: v9.56,26.45 9.56,24.93 J1.24
OUT+
  Top 0.152: IC2.A3 21.22,11.06 22.43,11.06 23.35,10.15 24.87,10.15 25.33,10.6 25.33,12.43 23.2,14.56 23.2,16.77 24.49,18.07 TP_OP.TP
OUT-  (via drill 0.35)
  Top 0.152: v21.9,10.45 21.52,10.07 21.22,10.07 IC2.C3 | v24.64,14.03 24.64,15.4 24.49,15.56 TP_ON.TP
  Bottom 0.152: v21.9,10.45 21.9,11.29 v24.64,14.03
P0.13/1.5D
  Top 0.152: SW_UP.2 10.7,4.05 10.7,4.96 C30.2 10.78,4.96 10.85,4.96 11.16,5.27 11.77,5.27 R5.1
P0.14/1.5D
  Top 0.152: 20.07,3.97 21.52,3.97 SW_ENT.2 | 20.07,3.97 C31.2 20.07,3.97 | 20.07,3.97 19.62,3.97 19.31,4.28 18.93,4.28 17.25,5.95 11.54,5.95 9.79,7.71 9.79,8.77 13.75,12.74 14.74,12.74 15.12,12.36 17.86,12.36 18.02,12.51 18.02,12.81 18.4,13.19 18.47,13.19 18.62,13.34 R8.1
P0.15/1.5D
  Top 0.152: 25.41,4.96 21.29,4.96 21.06,5.19 R7.1 | 25.41,4.96 C29\.2 25.41,4.96 | 25.41,4.96 25.56,4.96 26.09,5.5 29.45,5.5 30.89,4.05 32.57,4.05 SW_DN.2
P1.01/1.6C
  Top 0.152: R_PWR_EPD.1 18.7,15.02 19.08,15.02 20.3,16.24 Q1.1
PMIC_INT  (via drill 0.2, 0.35)
  Top 0.152: U1.P$T2 30.74,22.57 v30.74,22.59 | IC1.A1 30.89,13.95 30.89,14.03 30.89,18.45 30.28,19.06 30.28,19.98 v30.21,20.05
  Route2 0.152: 30.74,22.57 v30.74,22.59
  Bottom 0.152: v30.21,20.05 29.52,20.74 29.52,21.19 v29.47,21.25 29.6,21.19 29.67,21.19 30.74,22.26 30.74,22.57 v30.74,22.59
PREVGH  (via drill 0.35)
  Top 0.152: v12.15,22.34 13.06,22.34 EPD_C10.2 | v8.41,28.28 8.41,29.42 D5.1
  Bottom 0.152: v12.15,22.34 11.31,22.34 J1.22 11.23,22.34 10.78,22.34 10.62,22.49 10.62,23.02 8.41,25.23 v8.41,28.28
PREVGL  (via drill 0.35)
  Top 0.152: v10.17,25.23 9.63,25.77 8.79,25.77 EPD_C11.2 | v15.96,29.73 16.8,30.57 D2.2
  Bottom 0.152: 10.81,24.59 11.84,23.56 11.84,23.02 11.61,22.79 11.31,22.79 J1.23 | 10.81,24.59 v10.17,25.23 | v15.96,29.73 10.85,24.62 10.81,24.59
RESE  (via drill 0.35)
  Top 0.152: v13.6,11.59 13.9,11.9 13.9,12.28 R1_EP_DR.2 | v17.71,14.26 17.56,14.11 17.56,13.19 Q3.2
  Bottom 0.152: J1.3 11.31,12.74 11.61,12.74 12.76,11.59 v13.6,11.59 13.6,11.82 16.49,14.72 17.1,14.72 17.56,14.26 v17.71,14.26
RESET  (via drill 0.2, 0.35)
  Top 0.152: U1.P$AC13 33.56,20.89 v33.54,20.84 | v33.48,19.75 33.48,16.85 33.33,16.7 TP_RESET.TP | J2.6 38.24,16.55 v38.24,18.42
  Route2 0.152: v33.48,19.75 34.17,19.06 36.99,19.06 37.6,18.45 38.21,18.45 v38.24,18.42
  Bottom 0.152: v33.48,19.75 33.48,20.81 v33.54,20.84
SCL/1.4C
  Top 0.152: IC2.C1 20.15,9.99 19.08,9.99 17.41,8.32 13.29,8.32 U3.7
SCL/2.4C  (via drill 0.2, 0.35)
  Top 0.152: U1.P$M2 30.74,23.63 v30.74,23.6 | IC1.B1 30.89,13.5 30.82,13.5 29.75,13.5 29.6,13.65 R17.2 | 29.52,13.73 R17.2 | v27.24,12.58 27.24,13.27 IC3.12 | v28.91,8.09 29.14,7.86 30.13,7.86 R4.1 | v24.64,12.2 24.03,12.81 23.2,12.81 TP_SCL.TP | v29.52,14.72 29.52,13.8 R17.2
  Route2 0.152: v29.52,14.72 29.06,15.17 29.06,20.13 28.91,20.28 28.91,22.19 30.36,23.63 30.37,23.63 30.74,23.63 v30.74,23.6
  Bottom 0.152: 27.39,12.58 v27.24,12.58 | v28.91,8.09 28.91,8.32 27.46,9.76 27.46,11.97 | 27.46,11.97 27.46,12.58 27.39,12.58 | 27.39,12.58 v27.24,12.58 | v24.64,12.2 25.71,12.2 25.94,11.97 27.46,11.97 | 27.39,12.58 v29.52,14.72 | 27.39,12.58 v27.24,12.58
SDA/1.4C  (via drill 0.2, 0.35)
  Top 0.152: v17.94,9.76 16.72,9.76 15.73,8.77 13.29,8.77 U3.8
  Bottom 0.152: v17.94,9.76 18.7,10.53 20.68,10.53 IC2.B2
  other vias: 20.71,10.53
SDA/2.4C  (via drill 0.2, 0.35)
  Top 0.152: 28.84,13.12 28.61,13.12 27.92,13.8 27.77,13.8 IC3.2 | IC1.C1 30.89,13.12 30.82,13.12 28.84,13.12 | 28.84,10.15 28.91,10.15 29.22,9.84 29.22,8.7 29.45,8.47 30.89,8.47 R2.1 | 28.84,10.15 28.3,10.15 28,9.84 28,9.15 R18.2 | 28.84,13.12 v28.84,12.96 28.84,13.12 | 28.84,10.15 v28.84,11.14 | v30.21,14.11 30.21,14.95 29.45,15.71 29.45,16.24 TP_SDA.TP 29.45,16.32 29.67,16.55 29.67,19.14 v29.7,19.18 29.6,19.14 28.45,19.14 27.54,20.05 v26.85,20.05 | U1.P$L1 29.35,23.86 v29.32,23.88
  Bottom 0.152: v28.84,11.14 v28.84,12.96 29.98,14.11 v30.21,14.11 | v26.85,20.05 26.85,21.8 28.91,23.86 29.29,23.86 v29.32,23.88
SWDCLK  (via drill 0.2, 0.35)
  Top 0.152: v37.45,21.5 37.37,21.42 36.84,21.42 U1.P$AA24 | v43.24,10.91 43.24,9.38 41.71,7.86 TP_SWDCLK.TP | 43.06,14.46 v43.19,14.59 43.06,14.46 | 43.06,14.46 J2.4
  Bottom 0.152: v37.45,21.5 37.9,21.5 43.24,16.17 43.24,14.64 | v43.24,10.91 43.24,14.64 | 43.24,14.64 v43.19,14.59
SWDIO  (via drill 0.35)
  Top 0.152: v37.45,20.58 37.22,20.81 36.84,20.81 U1.P$AC24 | v32.27,15.4 32.27,15.25 33.26,14.26 TP_SWDIO.TP 33.64,14.59 34.98,14.59 | 34.98,14.59 35,14.61 | 34.98,14.59 36.71,14.59 37.66,14.59 J2.2
  Bottom 0.152: v32.27,15.4 v37.45,20.58
SWO
  Top 0.152: U1.P$AD22 35.85,20.43 36.15,20.74 36.38,20.74 37.75,19.37 41.33,19.37 TP_SWO.TP
VBAT/1.2A  (via drill 0.35)
  Top 0.152: 10.81,8.43 10.93,8.32 11.31,8.32 U3.2 11.39,8.24 11.39,7.78 U3.3 | 10.81,8.43 10.7,8.55 10.7,9 11.92,10.22 12.83,10.22 C27.2 | v10.4,8.01 10.78,8.39 10.81,8.43 | v14.51,3.9 15.27,3.9 TP_VBAT.TP
  Bottom 0.152: v14.51,3.9 v10.4,8.01
VBAT/2.5C
  Top 0.152: 31.43,13.12 31.35,13.12 | 31.35,13.12 IC1.C2 | C37.2 32.95,5.57 32.49,6.03 32.49,8.01 32.11,8.39 32.11,12.43 31.43,13.12 | 31.43,13.12 31.35,13.12
VBUS/1.5D  (via drill 0.35)
  Top 0.152: C42.1 24.49,27.21 22.51,25.23 v21.67,25.23 | v21.67,25.23 17.63,25.23 17.41,25.46 17.41,25.84 17.71,26.15 17.86,26.15 C43.1 | C42.1 | J4.A4_B9 26.17,28.84 C42.1 | 21.47,28.81 21.4,28.81 J4.A9_B4 21.67,28.54 v21.67,25.23
  Bottom 0.152: v21.67,25.23 22.13,24.78 22.82,24.78 D3.5
VBUS/2.6D
  Top 0.152: 33.1,11.9 33.1,11.44 C21.1 | 33.1,11.9 33.1,12.36 31.58,13.88 31.43,13.88 31.35,13.88 IC1.A2 31.27,13.95 31.27,14.03 31.27,18.53 30.82,18.98 30.82,20.28 U1.P$AD2 30.82,20.36 | 33.1,11.9 33.87,11.9 34.09,11.67 34.09,11.14 33.79,10.83 C38.2
VREG
  Top 0.152: IC1.B2 31.35,13.5 31.5,13.5 32.42,12.58 32.42,8.7 32.95,8.16 C23.1 32.95,8.09 32.95,7.33 | 32.95,7.33 32.95,6.87 C39.1 | IC9.A3 27.24,6.34 27.54,6.34 IC9.A2 27.62,6.34 27.92,6.34 IC9.A1 28,6.26 31.73,6.26 32.8,5.19 34.7,5.19 35.16,5.65 C24.2 | TP_VREG.TP 37.75,4.89 36,4.89 35.24,5.65 C24.2 | 32.95,7.33 35.62,7.33 35.85,7.1 35.85,6.34 35.24,5.73 C24.2